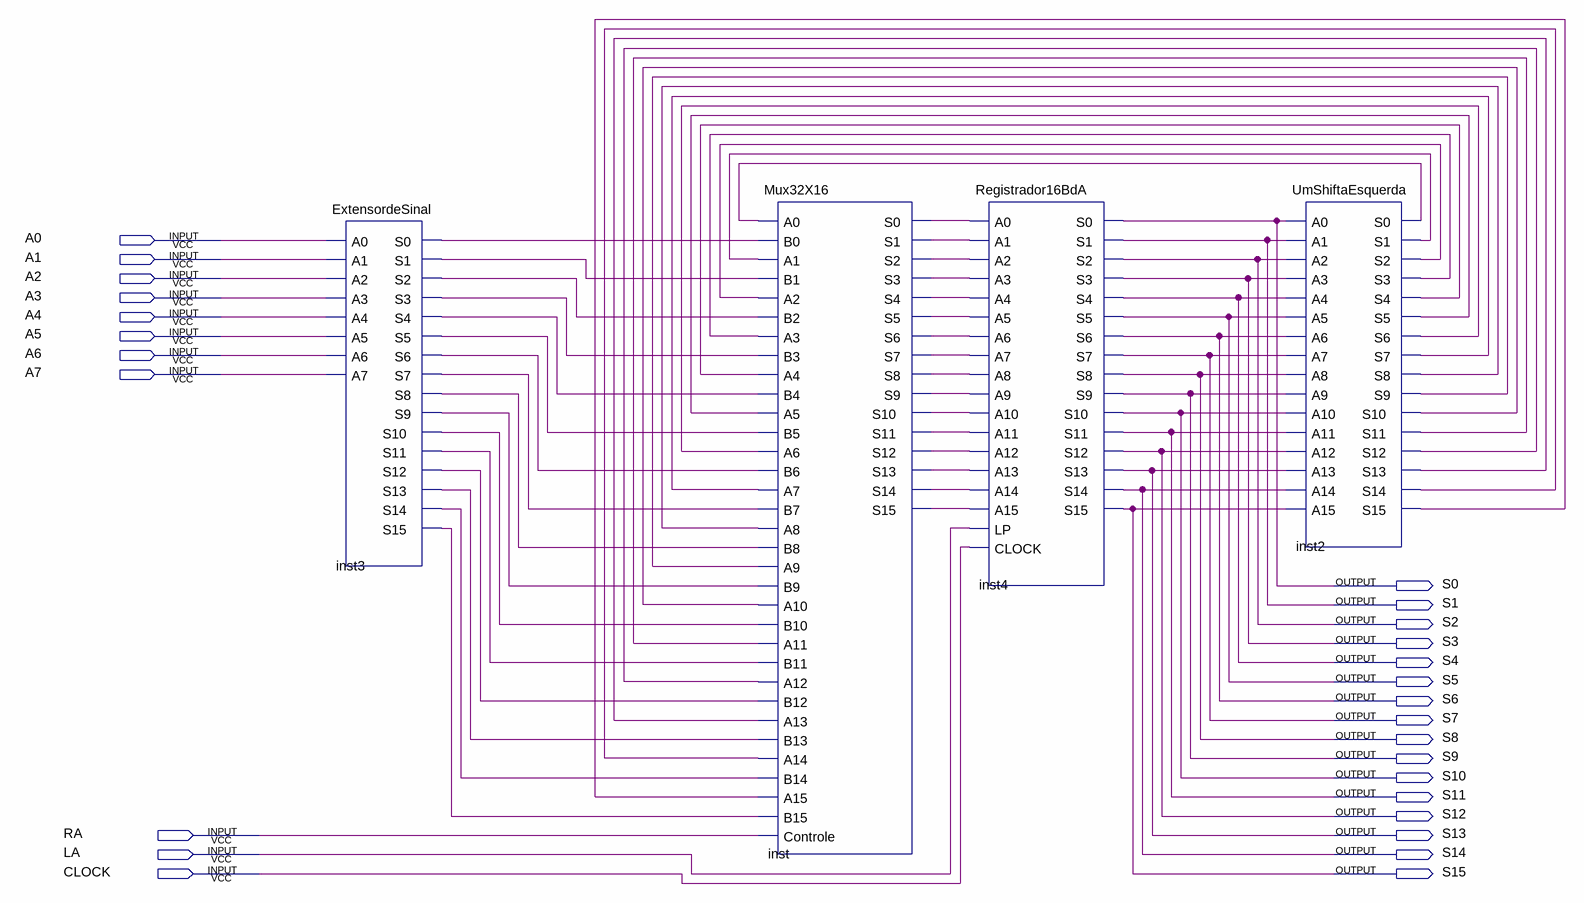
[diagram p0: schematic sheet]
// Quartus schematic CircuitodeA.bdf as structural Verilog: 4 symbols, 27 pins
module CircuitodeA (
  input  A0,
  input  A1,
  input  A2,
  input  A3,
  input  A4,
  input  A5,
  input  A6,
  input  A7,
  input  RA,
  input  LA,
  input  CLOCK,
  output S0,
  output S1,
  output S2,
  output S3,
  output S4,
  output S5,
  output S6,
  output S7,
  output S8,
  output S9,
  output S10,
  output S11,
  output S12,
  output S13,
  output S14,
  output S15
);

  wire inst2_s0, inst2_s1, inst2_s2, inst2_s3, inst2_s4, inst2_s5, inst2_s6, inst2_s7, inst2_s8, inst2_s9,
       inst2_s10, inst2_s11, inst2_s12, inst2_s13, inst2_s14, inst2_s15, inst3_s0, inst3_s1, inst3_s2,
       inst3_s3, inst3_s4, inst3_s5, inst3_s6, inst3_s7, inst3_s8, inst3_s9, inst3_s10, inst3_s11, inst3_s12,
       inst3_s13, inst3_s14, inst3_s15, inst_s0, inst_s1, inst_s2, inst_s3, inst_s4, inst_s5, inst_s6,
       inst_s7, inst_s8, inst_s9, inst_s10, inst_s11, inst_s12, inst_s13, inst_s14, inst_s15;

  ExtensordeSinal inst3 (
    .A0(A0), .A1(A1), .A2(A2), .A3(A3), .A4(A4), .A5(A5), .A6(A6), .A7(A7), .S0(inst3_s0), .S1(inst3_s1),
    .S2(inst3_s2), .S3(inst3_s3), .S4(inst3_s4), .S5(inst3_s5), .S6(inst3_s6), .S7(inst3_s7), .S8(inst3_s8),
    .S9(inst3_s9), .S10(inst3_s10), .S11(inst3_s11), .S12(inst3_s12), .S13(inst3_s13), .S14(inst3_s14),
    .S15(inst3_s15));
  Mux32X16 inst (
    .A0(inst2_s0), .B0(inst3_s0), .A1(inst2_s1), .B1(inst3_s1), .A2(inst2_s2), .B2(inst3_s2), .A3(inst2_s3),
    .B3(inst3_s3), .A4(inst2_s4), .B4(inst3_s4), .A5(inst2_s5), .B5(inst3_s5), .A6(inst2_s6), .B6(inst3_s6),
    .A7(inst2_s7), .B7(inst3_s7), .A8(inst2_s8), .B8(inst3_s8), .A9(inst2_s9), .B9(inst3_s9),
    .A10(inst2_s10), .B10(inst3_s10), .A11(inst2_s11), .B11(inst3_s11), .A12(inst2_s12), .B12(inst3_s12),
    .A13(inst2_s13), .B13(inst3_s13), .A14(inst2_s14), .B14(inst3_s14), .A15(inst2_s15), .B15(inst3_s15),
    .Controle(RA), .S0(inst_s0), .S1(inst_s1), .S2(inst_s2), .S3(inst_s3), .S4(inst_s4), .S5(inst_s5),
    .S6(inst_s6), .S7(inst_s7), .S8(inst_s8), .S9(inst_s9), .S10(inst_s10), .S11(inst_s11), .S12(inst_s12),
    .S13(inst_s13), .S14(inst_s14), .S15(inst_s15));
  Registrador16BdA inst4 (
    .A0(inst_s0), .A1(inst_s1), .A2(inst_s2), .A3(inst_s3), .A4(inst_s4), .A5(inst_s5), .A6(inst_s6),
    .A7(inst_s7), .A8(inst_s8), .A9(inst_s9), .A10(inst_s10), .A11(inst_s11), .A12(inst_s12), .A13(inst_s13),
    .A14(inst_s14), .A15(inst_s15), .LP(LA), .CLOCK(CLOCK), .S0(S0), .S1(S1), .S2(S2), .S3(S3), .S4(S4),
    .S5(S5), .S6(S6), .S7(S7), .S8(S8), .S9(S9), .S10(S10), .S11(S11), .S12(S12), .S13(S13), .S14(S14),
    .S15(S15));
  UmShiftaEsquerda inst2 (
    .A0(S0), .A1(S1), .A2(S2), .A3(S3), .A4(S4), .A5(S5), .A6(S6), .A7(S7), .A8(S8), .A9(S9), .A10(S10),
    .A11(S11), .A12(S12), .A13(S13), .A14(S14), .A15(S15), .S0(inst2_s0), .S1(inst2_s1), .S2(inst2_s2),
    .S3(inst2_s3), .S4(inst2_s4), .S5(inst2_s5), .S6(inst2_s6), .S7(inst2_s7), .S8(inst2_s8), .S9(inst2_s9),
    .S10(inst2_s10), .S11(inst2_s11), .S12(inst2_s12), .S13(inst2_s13), .S14(inst2_s14), .S15(inst2_s15));
endmodule
